# Altium schematic sheet power.SchDoc: AudioBound - Power
size Letter; CheckedBy: J. Brinton; CompanyName: Brinton Engineering, LLC; DrawnBy: J. Brinton; Engineer: J. Brinton; Address1: 3479 Edison Way; Address2: Menlo Park CA 94025; Revision: 1; SheetNumber: 3; SheetTotal: 3
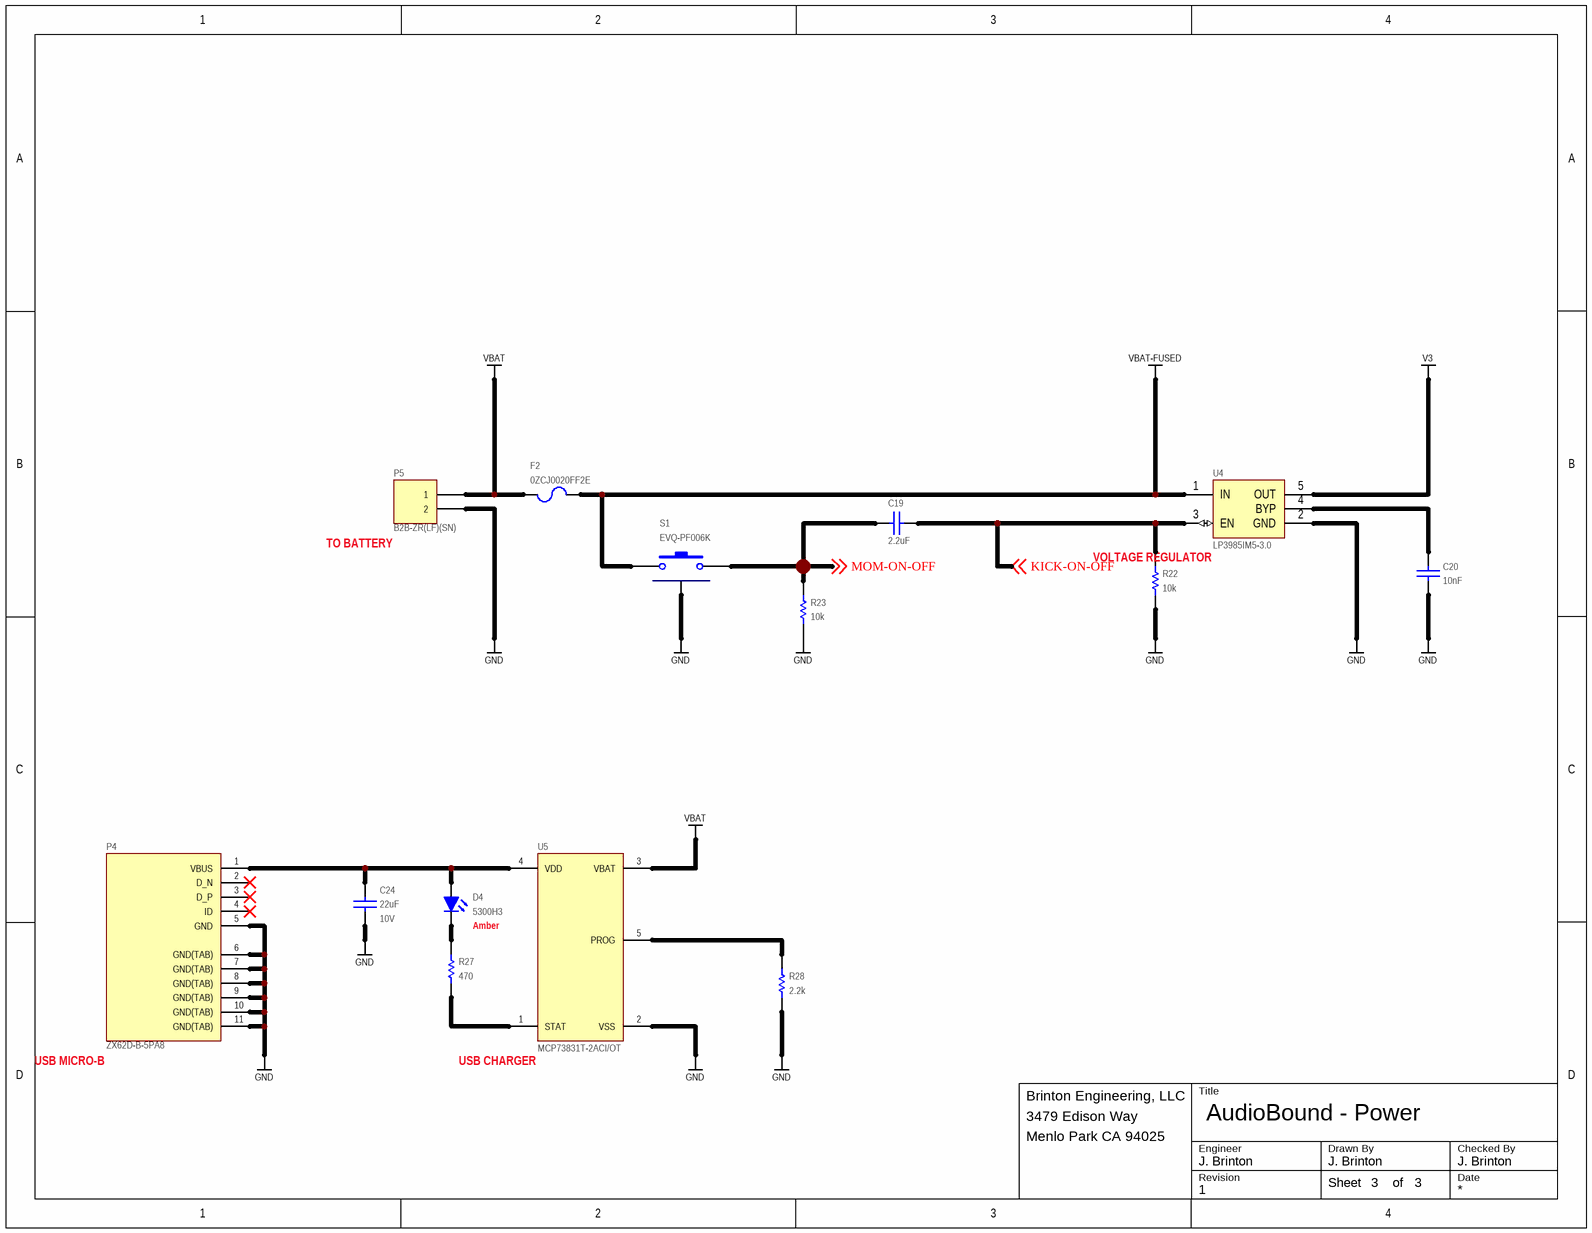
[diagram p0: power.SchDoc]

## Parts
C19  value 2.2uF  [CAPC160X80X90L20N]  (hidden comment: C1608X7R1A225M080)
C20  value 10nF  [CAPC100X50X55L25N]  (hidden comment: GRM155R71H103KA88)
C24  value 22uF  Voltage: 10V  [CAPC200X125X145L45N]  (hidden comment: C2012X7S1A226M125)
D4  5300H3  [5300Hx]
F2  0ZCJ0020FF2E  [1206]
P4  ZX62D-B-5PA8  [ZX62D-B-5PA8]
P5  B2B-ZR(LF)(SN)  [B2B-ZR]
R22  value 10k  [RESC1005X40N]  (hidden comment: ERJ-2RKF1002X)
R23  value 10k  [RESC1005X40N]  (hidden comment: ERJ-2RKF1002X)
R27  value 470  [RESC1005X40N]  (hidden comment: ERJ-2RKF4700X)
R28  value 2.2k  [RESC1005X40N]  (hidden comment: ERJ-2RKF2201X)
S1  EVQ-PF006K  [EVQ-PF006K]
U4  LP3985IM5-3.0  [DBV-5]
U5  MCP73831T-2ACI/OT  [SOT23-5]

## Nets
GND: C20.1 C24.2 P4.5(GND) P4.6(GND(TAB)) P4.7(GND(TAB)) P4.8(GND(TAB)) P4.9(GND(TAB)) P4.10(GND(TAB)) P4.11(GND(TAB)) P5.2 R22.1 R23.2 R28.2 S1.3 U4.2(GND) U5.2(VSS)
V3: U4.5(OUT)
VBAT: F2.2 P5.1 U5.3(VBAT)
VBAT-FUSED: F2.1 S1.1 U4.1(IN)
KICK-ON-OFF: C19.1 R22.2 U4.3(EN) ; off-sheet KICK-ON-OFF
MOM-ON-OFF: C19.2 R23.1 S1.2 ; off-sheet MOM-ON-OFF
NetC20_2: C20.2 U4.4(BYP)
NetC24_1: C24.1 D4.1(A) P4.1(VBUS) U5.4(VDD)
NetD4_2: D4.2(K) R27.1
NetR27_2: R27.2 U5.1(STAT)
NetR28_1: R28.1 U5.5(PROG)

Not connected (* = marked no-connect by the designer): P4 2(D_N)* 3(D_P)* 4(ID)*

## Notes on the sheet
- (near P5) TO BATTERY
- (near U4) VOLTAGE REGULATOR
- Amber
- (near P4) USB MICRO-B
- (near U5) USB CHARGER
- Title
- Engineer
- Revision
- Drawn By
- Checked By
- Date
- Sheet
- of

## Library data of the parts
C19 = CAP: Ceramic Capacitor 2.2uF ±20% 10V X7R 0603; Manufacturer: TDK; Tr: -55:125; Tolerance: ±20%; Manufacturer P/N: C1608X7R1A225M080; Package: 0603; Voltage: 10V
C20 = CAP: Ceramic Capacitor 10nF ±10% 50V X7R 0402; Manufacturer: Murata; Tr: -55:125; Tolerance: ±10%; Manufacturer P/N: GRM155R71H103KA88; Voltage: 50V; Package: 0402
C24 = CAP: Ceramic Capacitor 22uF ±20% 10V X7S 0805; Manufacturer: TDK; Tr: -55:125; Manufacturer P/N: C2012X7S1A226M125; Tolerance: ±20%; Package: 0805
D4 = LED0603RD: LED, Color Amber, 10mA, 2.0V; Manufacturer: Visual Communications Company; Manufacturer P/N: 5300H3
F2 = 0ZCJ0020FF2E: PTC Resettable Fuse, 0.2A, 30V, SMD 1206; Manufacturer: Bell Fuse; Manufacturer P/N: 0ZCJ0020FF2E
P4 = ZX62D-B-5PA8: USB Micro-B SMD Connector; Manufacturer: Hirose; Manufacturer P/N: ZX62D-B-5PA8
P5 = Header 2: Header, 2-Pin; Manufacturer: JST; Manufacturer P/N: B2B-ZR(LF)(SN)
R22 R23 = RES: Thick Film Resistor 10k ±1% 0.1W 50V 0402; Manufacturer: Panasonic; Tcr: ±100; Tr: -55:155; Voltage: 50; Power: 0.1; Manufacturer P/N: ERJ-2RKF1002X; Tolerance: ±1%; Alternatives: *; Footprint: *; Package: 0402
R27 = RES: Thick Film Resistor 470 ±1% 0.1W 50V 0402; Manufacturer: Panasonic; Tcr: ±100; Tr: -55:155; Voltage: 50; Power: 0.1; Manufacturer P/N: ERJ-2RKF4700X; Tolerance: ±1%; Alternatives: *; Footprint: *; Package: 0402
R28 = RES: Thick Film Resistor 2.2k ±1% 0.1W 50V 0402; Manufacturer: Panasonic; Tcr: ±100; Tr: -55:155; Voltage: 50; Power: 0.1; Manufacturer P/N: ERJ-2RKF2201X; Tolerance: ±1%; Alternatives: *; Footprint: *; Package: 0402
S1 = EVQ-PF006K: Tactile Switch; Normally Open; Manufacturer: Panasonic; Manufacturer P/N: EVQ-PF006K
U4 = LP3985IM5-2.5: Low Dropout Regulator, Fixed, 150mA, 30uV Low Noise, 3.0V; Manufacturer: Texas Instruments; Manufacturer P/N: LP3985IM5-3.0; Voltage: 3.0V
U5 = MCP73831T-2ACI/OT: Single-Cell LiPo Charger; Manufacturer: Microchip; Manufacturer P/N: MCP73831T-2ACI/OT